# Altium schematic sheet Sheet1.SchDoc: dsPIC33FJ128GP804 development board
size A4; CheckedBy: Matej Gomboc; Author: Matej Gomboc; DrawnBy: Matej Gomboc; Engineer: Matej Gomboc; DocumentNumber: 1; Revision: 1.0; SheetNumber: 1; SheetTotal: 1; VersionControl_RevNumber: 1.0; ProjectName: dsPIC33FJ128GP804 development board
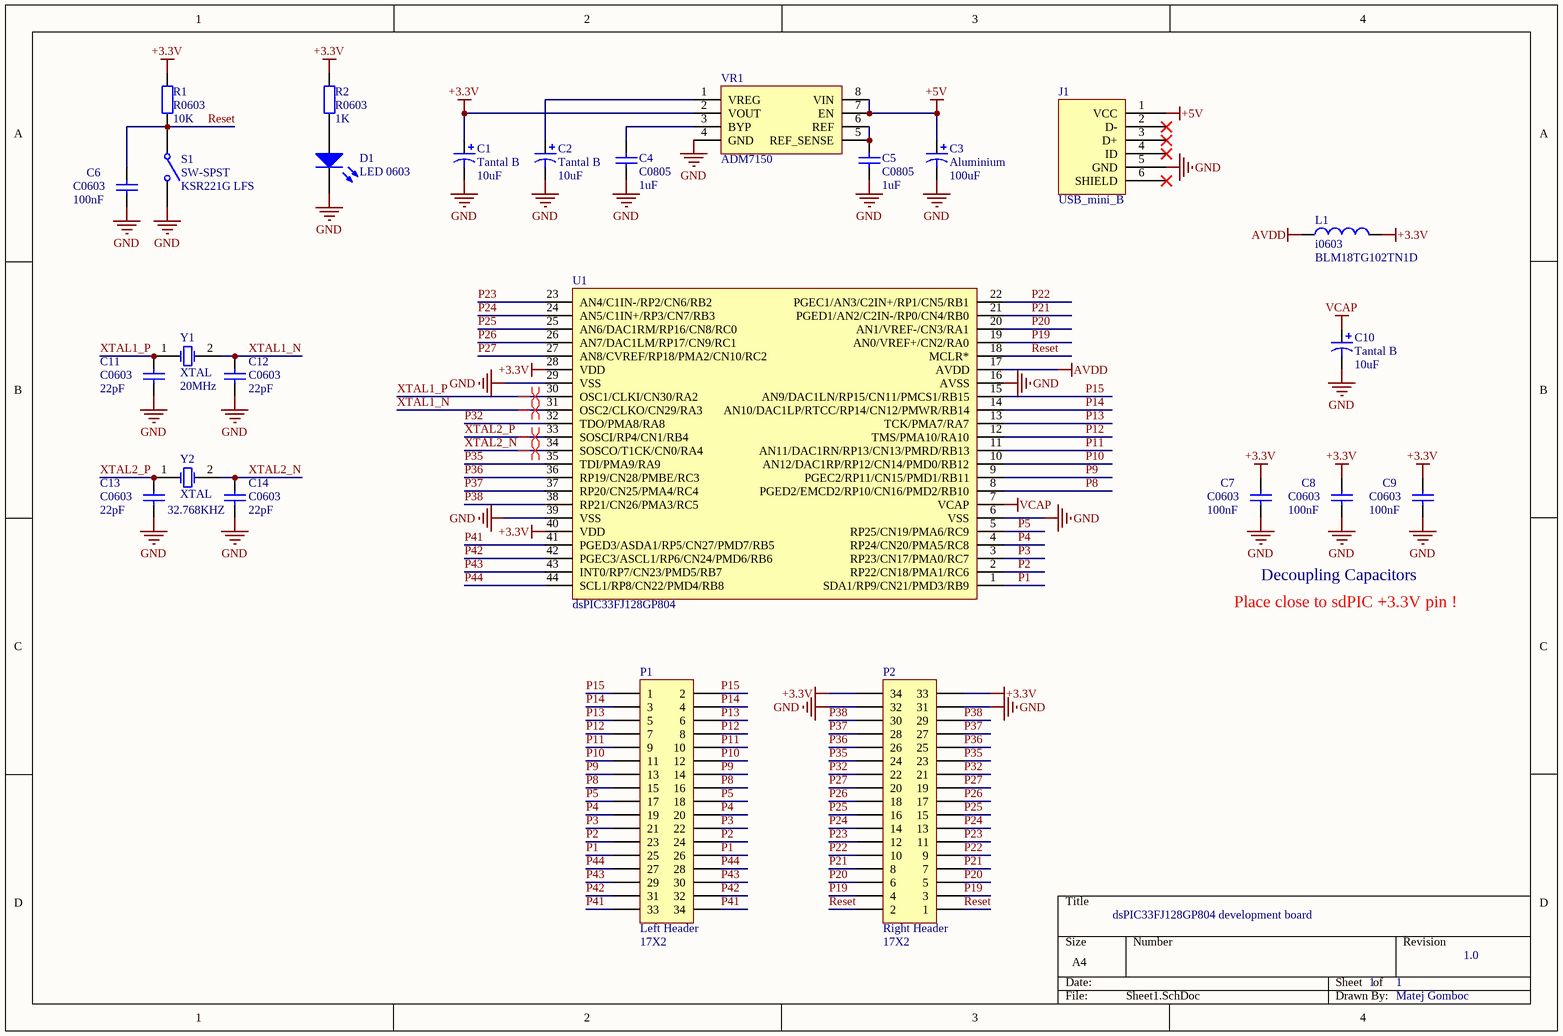
[diagram p0: Sheet1.SchDoc]

## Parts
C1  Tantal B  value 10uF  [AVX-CAPC3528_V]
C2  Tantal B  value 10uF  [AVX-CAPC3528_V]
C3  Aluminium  value 100uF  [Panasonic Size D8]
C4  C0805  value 1uF  [C0805]
C5  C0805  value 1uF  [C0805]
C6  C0603  value 100nF  [0603_HandSoldering]
C7  C0603  value 100nF  [0603_HandSoldering]
C8  C0603  value 100nF  [0603_HandSoldering]
C9  C0603  value 100nF  [0603_HandSoldering]
C10  Tantal B  value 10uF  [AVX-CAPC3528_V]
C11  C0603  value 22pF  [0603_HandSoldering]
C12  C0603  value 22pF  [0603_HandSoldering]
C13  C0603  value 22pF  [0603_HandSoldering]
C14  C0603  value 22pF  [0603_HandSoldering]
D1  LED 0603  [0603_LED]
J1  USB_mini_B  [USB mini B receptacle]
L1  i0603  value BLM18TG102TN1D  [0603_HandSoldering]
P1  Left Header  value 17X2  [HDR2X17]
P2  Right Header  value 17X2  [HDR2X17]
R1  R0603  value 10K  [0603_HandSoldering]
R2  R0603  value 1K  [0603_HandSoldering]
S1  SW-SPST  value KSR221G LFS  [KSR221G_LFS_Tactile_Switch]
U1  dsPIC33FJ128GP804  [dsPIC33FJ128GP804_TQFP44]
VR1  ADM7150  [ADM7150_SOIC8]
Y1  XTAL  value 20MHz  [TXC  7A-20.000MAAJ-T  XTAL]
Y2  XTAL  value 32.768KHZ  [Raltron R26-32.768- 12.5  CRYSTAL]

## Nets
+3.3V: C1.1 C7.2 C8.2 C9.2 L1.2 P2.33 P2.34 R1.2 R2.2 U1.28(VDD) U1.40(VDD) VR1.2(VOUT)
+5V: C3.1 J1.1(VCC) VR1.7(EN) VR1.8(VIN)
AVDD: L1.1 U1.17(AVDD)
GND: C1.2 C2.2 C3.2 C4.1 C5.1 C6.1 C7.1 C8.1 C9.1 C10.2 C11.1 C12.1 C13.1 C14.1 D1.2(K) J1.5(GND) P2.31 P2.32 S1.2(NO) U1.6(VSS) U1.16(AVSS) U1.29(VSS) U1.39(VSS) VR1.4(GND)
VCAP: C10.1 U1.7(VCAP)
P1: P1.25 P1.26 U1.1(SDA1/RP9/CN21/PMD3/RB9)
P2: P1.23 P1.24 U1.2(RP22/CN18/PMA1/RC6)
P3: P1.21 P1.22 U1.3(RP23/CN17/PMA0/RC7)
P4: P1.19 P1.20 U1.4(RP24/CN20/PMA5/RC8)
P5: P1.17 P1.18 U1.5(RP25/CN19/PMA6/RC9)
P8: P1.15 P1.16 U1.8(PGED2/EMCD2/RP10/CN16/PMD2/RB10)
P9: P1.13 P1.14 U1.9(PGEC2/RP11/CN15/PMD1/RB11)
P10: P1.11 P1.12 U1.10(AN12/DAC1RP/RP12/CN14/PMD0/RB12)
P11: P1.9 P1.10 U1.11(AN11/DAC1RN/RP13/CN13/PMRD/RB13)
P12: P1.7 P1.8 U1.12(TMS/PMA10/RA10)
P13: P1.5 P1.6 U1.13(TCK/PMA7/RA7)
P14: P1.3 P1.4 U1.14(AN10/DAC1LP/RTCC/RP14/CN12/PMWR/RB14)
P15: P1.1 P1.2 U1.15(AN9/DAC1LN/RP15/CN11/PMCS1/RB15)
P19: P2.3 P2.4 U1.19(AN0/VREF+/CN2/RA0)
P20: P2.5 P2.6 U1.20(AN1/VREF-/CN3/RA1)
P21: P2.7 P2.8 U1.21(PGED1/AN2/C2IN-/RP0/CN4/RB0)
P22: P2.9 P2.10 U1.22(PGEC1/AN3/C2IN+/RP1/CN5/RB1)
P23: P2.11 P2.12 U1.23(AN4/C1IN-/RP2/CN6/RB2)
P24: P2.13 P2.14 U1.24(AN5/C1IN+/RP3/CN7/RB3)
P25: P2.15 P2.16 U1.25(AN6/DAC1RM/RP16/CN8/RC0)
P26: P2.17 P2.18 U1.26(AN7/DAC1LM/RP17/CN9/RC1)
P27: P2.19 P2.20 U1.27(AN8/CVREF/RP18/PMA2/CN10/RC2)
P32: P2.21 P2.22 U1.32(TDO/PMA8/RA8)
P35: P2.23 P2.24 U1.35(TDI/PMA9/RA9)
P36: P2.25 P2.26 U1.36(RP19/CN28/PMBE/RC3)
P37: P2.27 P2.28 U1.37(RP20/CN25/PMA4/RC4)
P38: P2.29 P2.30 U1.38(RP21/CN26/PMA3/RC5)
P41: P1.33 P1.34 U1.41(PGED3/ASDA1/RP5/CN27/PMD7/RB5)
P42: P1.31 P1.32 U1.42(PGEC3/ASCL1/RP6/CN24/PMD6/RB6)
P43: P1.29 P1.30 U1.43(INT0/RP7/CN23/PMD5/RB7)
P44: P1.27 P1.28 U1.44(SCL1/RP8/CN22/PMD4/RB8)
Reset: C6.2 P2.1 P2.2 R1.1 S1.1(COMMON) U1.18(MCLR*)
XTAL1_N: C12.2 U1.31(OSC2/CLKO/CN29/RA3) Y1.2(OSC2)
XTAL1_P: C11.2 U1.30(OSC1/CLKI/CN30/RA2) Y1.1(OSC1)
XTAL2_N: C14.2 U1.34(SOSCO/T1CK/CN0/RA4) Y2.2(OSC2)
XTAL2_P: C13.2 U1.33(SOSCI/RP4/CN1/RB4) Y2.1(OSC1)
NetC2_1: C2.1 VR1.1(VREG)
NetC4_2: C4.2 VR1.3(BYP)
NetC5_2: C5.2 VR1.5(REF_SENSE) VR1.6(REF)
NetD1_1: D1.1(A) R2.1

Not connected (* = marked no-connect by the designer): J1 2(D-)* 3(D+)* 4(ID)* 6(SHIELD)*

## Layout directives
differential pair: XTAL1_N, XTAL1_P, XTAL2_N, XTAL2_P

## Notes on the sheet
- Decoupling Capacitors
- Place close to sdPIC +3.3V pin !

## Library data of the parts
C1 C2 C10 = Cap Pol1: Tantalum Capacitor
C3 = Cap Pol1: Aluminium Capacitor
C4-C9 C11-C14 = Cap: Ceramic Capacitor
D1 = LED2: SMD LED 0603
J1 = USB_mini_B: USB 2.0 mini B receptacle
L1 = Inductor
P1 P2 = Header 17X2: Header, 17-Pin, Dual row
R1 R2 = Res2: Resistor
S1 = SW-SPST: KSR221G LFS Tactile Switch
U1 = dsPIC33FJ128GP804: dsPIC 40 MIPS
VR1 = ADM7150: 800 mA Ultralow Noise,  High PSRR, RF Linear Regulator
Y1 = XTAL: TXC  7A-20.000MAAJ-T  XTAL
Y2 = XTAL: RALTRON  R26-32.768- 12.5  CRYSTAL